# EAGLE design Magnetometer_v2 (EAGLE 6.2)
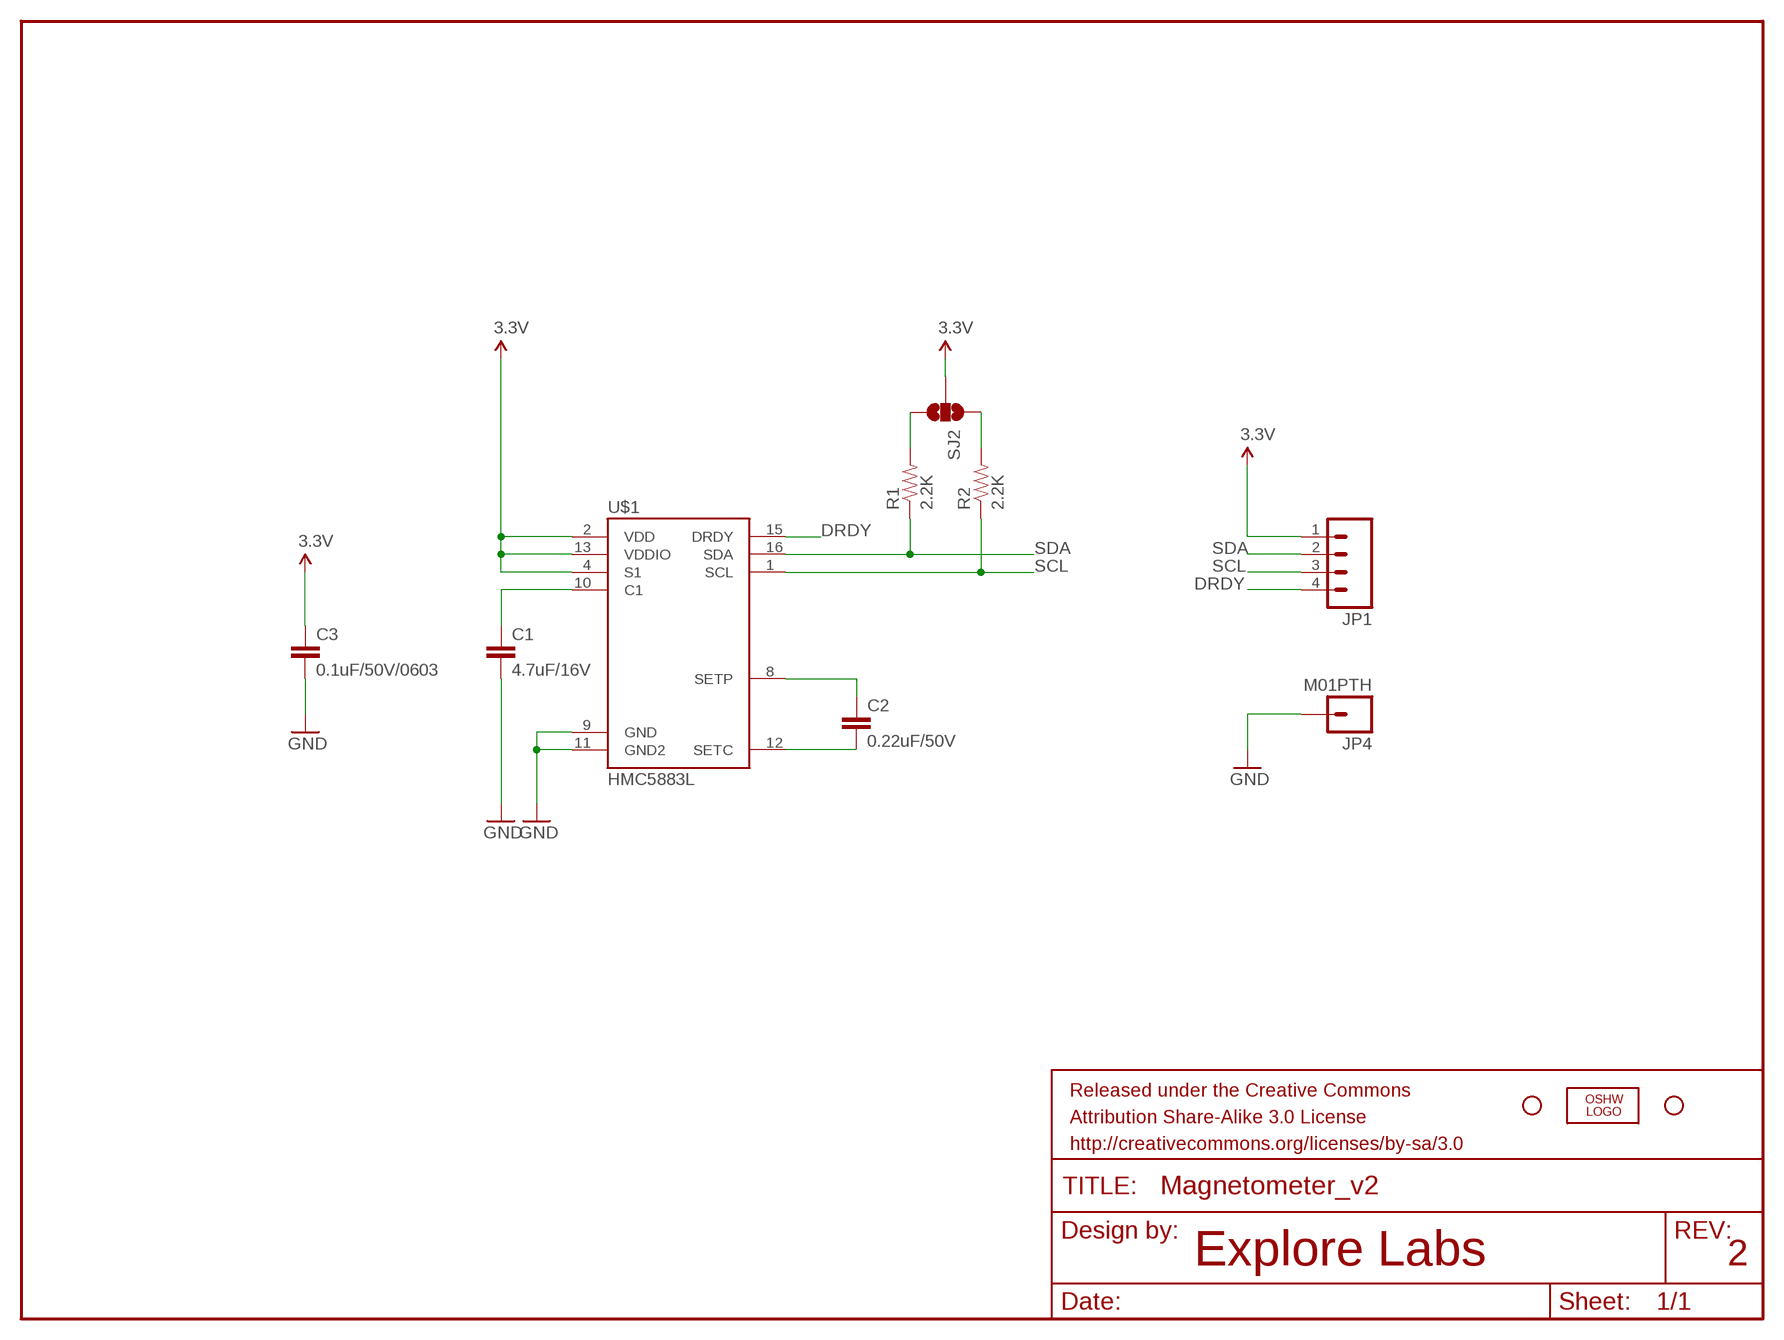
[diagram p0: schematic, sheet 1]

## Parts
C1  4.7uF/16V  CAP1206  [1206]
C2  0.22uF/50V  CAP1206  [1206]
C3  0.1uF/50V/0603  CAP0603-CAP  [0603-CAP]
JP1  M04PTH  [1X04]
JP2  STAND-OFFTIGHT  [STAND-OFF-TIGHT]
JP3  STAND-OFFTIGHT  [STAND-OFF-TIGHT]
JP4  M01PTH  [1X01]
LOGO1  OSHW_LOGO_FILLX0150-NT  [OSHW_FILLX150_NOTEXT]
R1  2.2K  RESISTOR0603-RES  [0603-RES]
R2  2.2K  RESISTOR0603-RES  [0603-RES]
SJ2  SOLDERJUMPER_2WAYS  [SJ_3]
U$1  HMC5883L  [LPCC16]

## Nets
3.3V: C3.1 JP1.1 SJ2.2 U$1.2(VDD) U$1.4(S1) U$1.13(VDDIO)
DRDY: JP1.4 U$1.15(DRDY)
GND: C1.2 C3.2 JP4.1 U$1.9(GND) U$1.11(GND2)
N$1: C2.1 U$1.8(SETP)
N$3: C1.1 U$1.10(C1)
N$4: R1.2 SJ2.3
N$5: R2.2 SJ2.1
N$6: C2.2 U$1.12(SETC)
SCL: JP1.3 R2.1 U$1.1(SCL)
SDA: JP1.2 R1.1 U$1.16(SDA)

## Notes on the sheet
- Explore Labs | 2

## Library data of the parts
C1-C3 = SparkFun-Passives:CAP: Capacitor Standard 0603 ceramic capacitor, and 0.1" leaded capacitor.
JP1 = SparkFun-Connectors:M04: Header 4 Standard 4-pin 0.1" header. Use with straight break away headers (SKU : PRT-00116), right angle break away headers (PRT-00553), swiss pins (PRT-00743), machine pins (PRT-00117), and female headers (PRT-00115). Molex polarized connector foot print use with SKU : PRT-08231 with associated crimp pins and housings. 1MM SMD Version SKU: PRT-10208
JP2 JP3 = SparkFun-Electromechanical:STAND-OFF: #4 Stand Off This is the mechanical footprint for a #4 phillips button head screw. Use the keepout ring to avoid running the screw head into surrounding components. SKU : PRT-00447
JP4 = SparkFun-Connectors:M01: Header 1 Standard 1-pin 0.1" header. Use with straight break away headers (SKU : PRT-00116), right angle break away headers (PRT-00553), swiss pins (PRT-00743), machine pins (PRT-00117), and female headers (PRT-00115).
LOGO1 = ohw-logo:OSHW_LOGO_FILL
R1 R2 = SparkFun-Passives:RESISTOR: Resistor Basic schematic elements and footprints for 0603, 1206, and PTH resistors.
SJ2 = SparkFun-Passives:SOLDERJUMPER_2WAY: Solder Jumper 2 way solder jumper
U$1 = 3DRobotics_edit:HMC5883L: Honeywell HMC5883L 3-axis digital compass IC Successor to the HMC5843.; DATASHEET: http://www.dsscircuits.com/images/datasheets/HMC5883L.pdf; LINK: http://parts.digikey.com/1/parts/2057013-ic-compass-3-axis-i2c-16lcc-smd-hmc5883l-tr.html; MFGPN: HMC5883L-TR

## Board
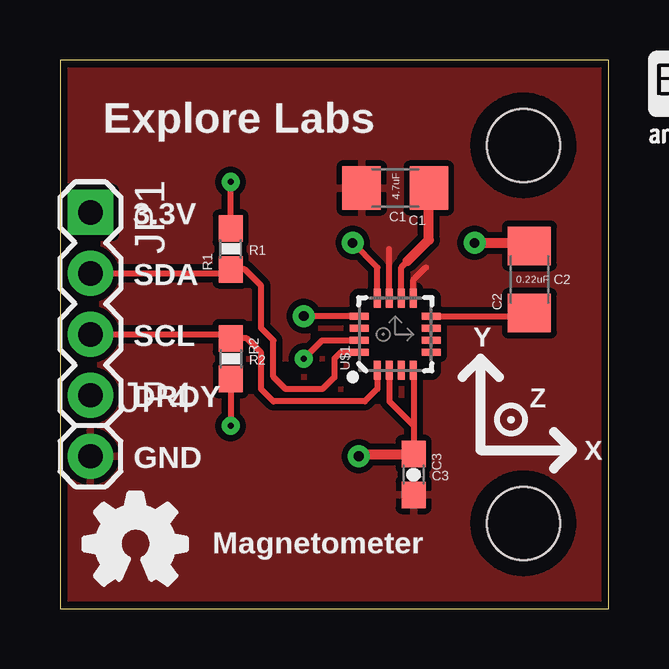
[diagram p1: board, top side]
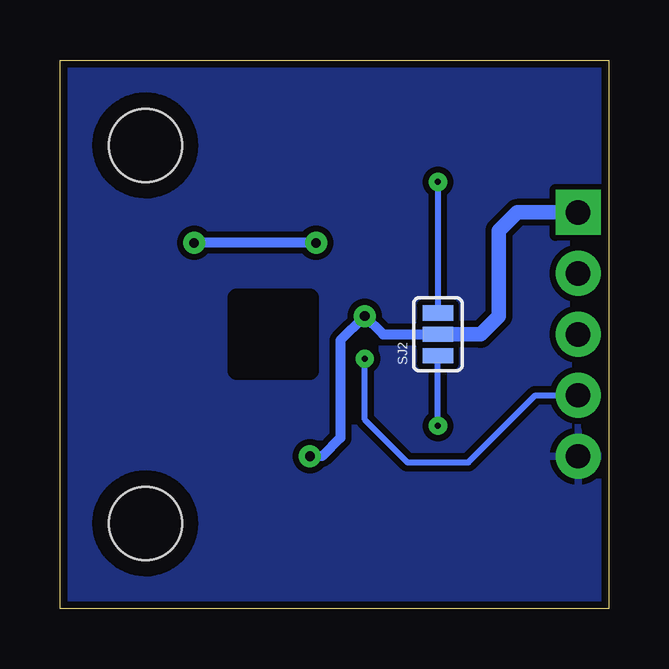
[diagram p2: board, bottom side, seen from below]

Size 22.86 x 22.86 mm. Coordinates in mm from the lower left corner, seen from the top.
Outline: 0,0 22.86,0 22.86,22.86 0,22.86 0,0
Copper layers (1*16): Top 0.035mm / dielectric 1.5mm / Bottom 0.035mm
Design rules: minimum track width 10mil, minimum drill 10mil, track to track 8mil, track to pad 8mil, pad to pad 8mil, via to via 8mil, smd to smd 8mil, copper to edge 12mil, drill to drill 8mil, minimum pad ring 12mil, minimum via ring 10mil, stop-mask expansion 4mil, vias tented up to drill 18mil, thermal gap 10mil
tRestrict: area 12.4,9.9 to 15.5,13; area 0.5,12.4 to 0.8,12.7; area 0.5,7.4 to 0.8,7.6; area 0.5,9.9 to 0.8,10.2; area 0.5,15 to 0.8,15.2; area 10.7,9.7 to 10.9,9.9; area 9.4,9.7 to 9.7,9.9; area 12.2,9.1 to 12.4,9.7
bRestrict: area 12.4,9.9 to 15.5,13; area 0.5,12.4 to 0.8,12.7; area 0.5,9.9 to 0.8,10.2; area 0.5,7.4 to 0.8,7.6; area 0.5,15 to 0.8,15.2; area 10.4,11.2 to 10.7,11.4

### Footprints (pad centres in the part's own frame; a part is rotated, then mirrored left to right if it is on the bottom)
1206 = smd 1.6 x 1.8: 1 -1.4,0; 2 1.4,0
0603-CAP = smd 1.1 x 1: 1 -0.85,0; 2 0.85,0
1X04 = drill 1.016 pad 1.88 square: 1 0,0 | drill 1.016 pad 1.88: 2 2.54,0; 3 5.08,0; 4 7.62,0
STAND-OFF-TIGHT = hole 3.048: 0,0
1X01 = drill 1.016 pad 1.88: 1 0,0
0603-RES = smd 1.1 x 1: 1 -0.85,0; 2 0.85,0
SJ_3 = smd 0.635 x 1.27: 1 -0.889,0; 2 0,0; 3 0.889,0
LPCC16 = smd 0.8 x 0.3: 1 -1.5,0.75; 2 -1.5,0.25; 3 -1.5,-0.25; 4 -1.5,-0.75; 9 1.5,-0.75; 10 1.5,-0.25; 11 1.5,0.25; 12 1.5,0.75 | smd 0.3 x 0.8: 5 -0.75,-1.5; 6 -0.25,-1.5; 7 0.25,-1.5; 8 0.75,-1.5; 13 0.75,1.5; 14 0.25,1.5; 15 -0.25,1.5; 16 -0.75,1.5

### Placement (x,y rotation side)
C1  13.97,17.53 180 top
C2  19.56,13.72 90 top
C3  14.73,5.59 270 top
JP1  1.27,16.51 270 top
JP2  19.3,19.3 0 top
JP3  19.3,3.56 0 top
JP4  1.27,6.35 0 top
LOGO1  1.02,1.02 0 top
R1  7.11,14.99 90 top
R2  7.11,10.41 270 top
SJ2  7.11,11.43 90 bottom
U$1  13.97,11.43 90 top
U$2  [EXLABS_LOGO_0.25]  24.13,18.29 0 top

### Tracks (layer width: path | path; a pad name or v marks a point on that pad's centre or on a via)
3.3V  (via drill 0.41)
  Top 0.254: U$1.13 10.17,12.18 v10.16,12.19 | 13.72,8.89 U$1.2 13.72,8.63 14.73,7.62 | U$1.4 14.73,9.92 14.73,7.62 | 14.73,7.62 C3.1
  Top 0.406: v12.45,6.35 12.53,6.44 C3.1
  Bottom 0.406: v12.45,6.35 11.94,6.35 11.18,7.11 11.18,11.18 v10.16,12.19 9.4,11.43 SJ2.2
  Bottom 0.61: JP1.1 3.81,16.51 4.57,15.75 4.57,12.19 5.33,11.43 SJ2.2
DRDY  (via drill 0.25)
  Top 0.254: v10.16,10.41 10.93,11.18 U$1.15
  Bottom 0.254: JP1.4 3.05,8.89 5.84,6.1 8.38,6.1 10.16,7.87 v10.16,10.41
GND
  Top 0.254: U$1.9 14.72,13.7 15.24,14.22 | U$1.11 13.72,14.99
  pour Top (isolate 0.254): 0,22.86 22.86,22.86 22.86,0 0,0
  pour Bottom (isolate 0.254): 0,22.86 22.86,22.86 22.86,0 0,0
N$1
  Top 0.254: U$1.8 19.42,12.18
  Top 0.406: 19.42,12.18 C2.1
N$3
  Top 0.254: U$1.10 14.22,14.22 14.48,14.48
  Top 0.406: C1.1 15.37,15.37 14.48,14.48
N$4  (via drill 0.25)
  Top 0.254: R1.2 v7.11,17.78
  Bottom 0.254: v7.11,17.78 SJ2.3
N$5  (via drill 0.25)
  Top 0.254: R2.2 v7.11,7.62
  Bottom 0.254: v7.11,7.62 SJ2.1
N$6  (via drill 0.41)
  Top 0.254: U$1.12 13.22,14.21 13.21,14.22 v12.19,15.24
  Top 0.406: v17.27,15.24 19.43,15.24 C2.2
  Bottom 0.406: v12.19,15.24 v17.27,15.24
SCL
  Top 0.254: JP1.3 6.95,11.43 R2.1 7.79,11.26 8.38,10.67 8.38,9.14 8.89,8.64 12.7,8.64 13.22,9.16 U$1.1
SDA
  Top 0.254: JP1.2 6.95,13.97 R1.1 7.71,14.14 8.38,13.46 8.38,11.68 8.89,11.18 8.89,9.65 9.4,9.14 10.93,9.14 11.43,9.64 11.43,10.41 11.7,10.68 U$1.16

### Text on the board
tTest: Immersion Silver for Magnetometer | or HAL
_tsilk: Explore Labs | 4.7uF | 3.3V | C1 | R1 | 0.22uF | C2 | SDA | SCL | Y | R2 | DRDY | Z | X | GND | 0.1 | C3 | Magnetometer
_bsilk: 3.3V | Pull | Ups | SDA | SCL | DRDY | GND